# EAGLE design TAH BOARD VER 3.0 (EAGLE 6.4)
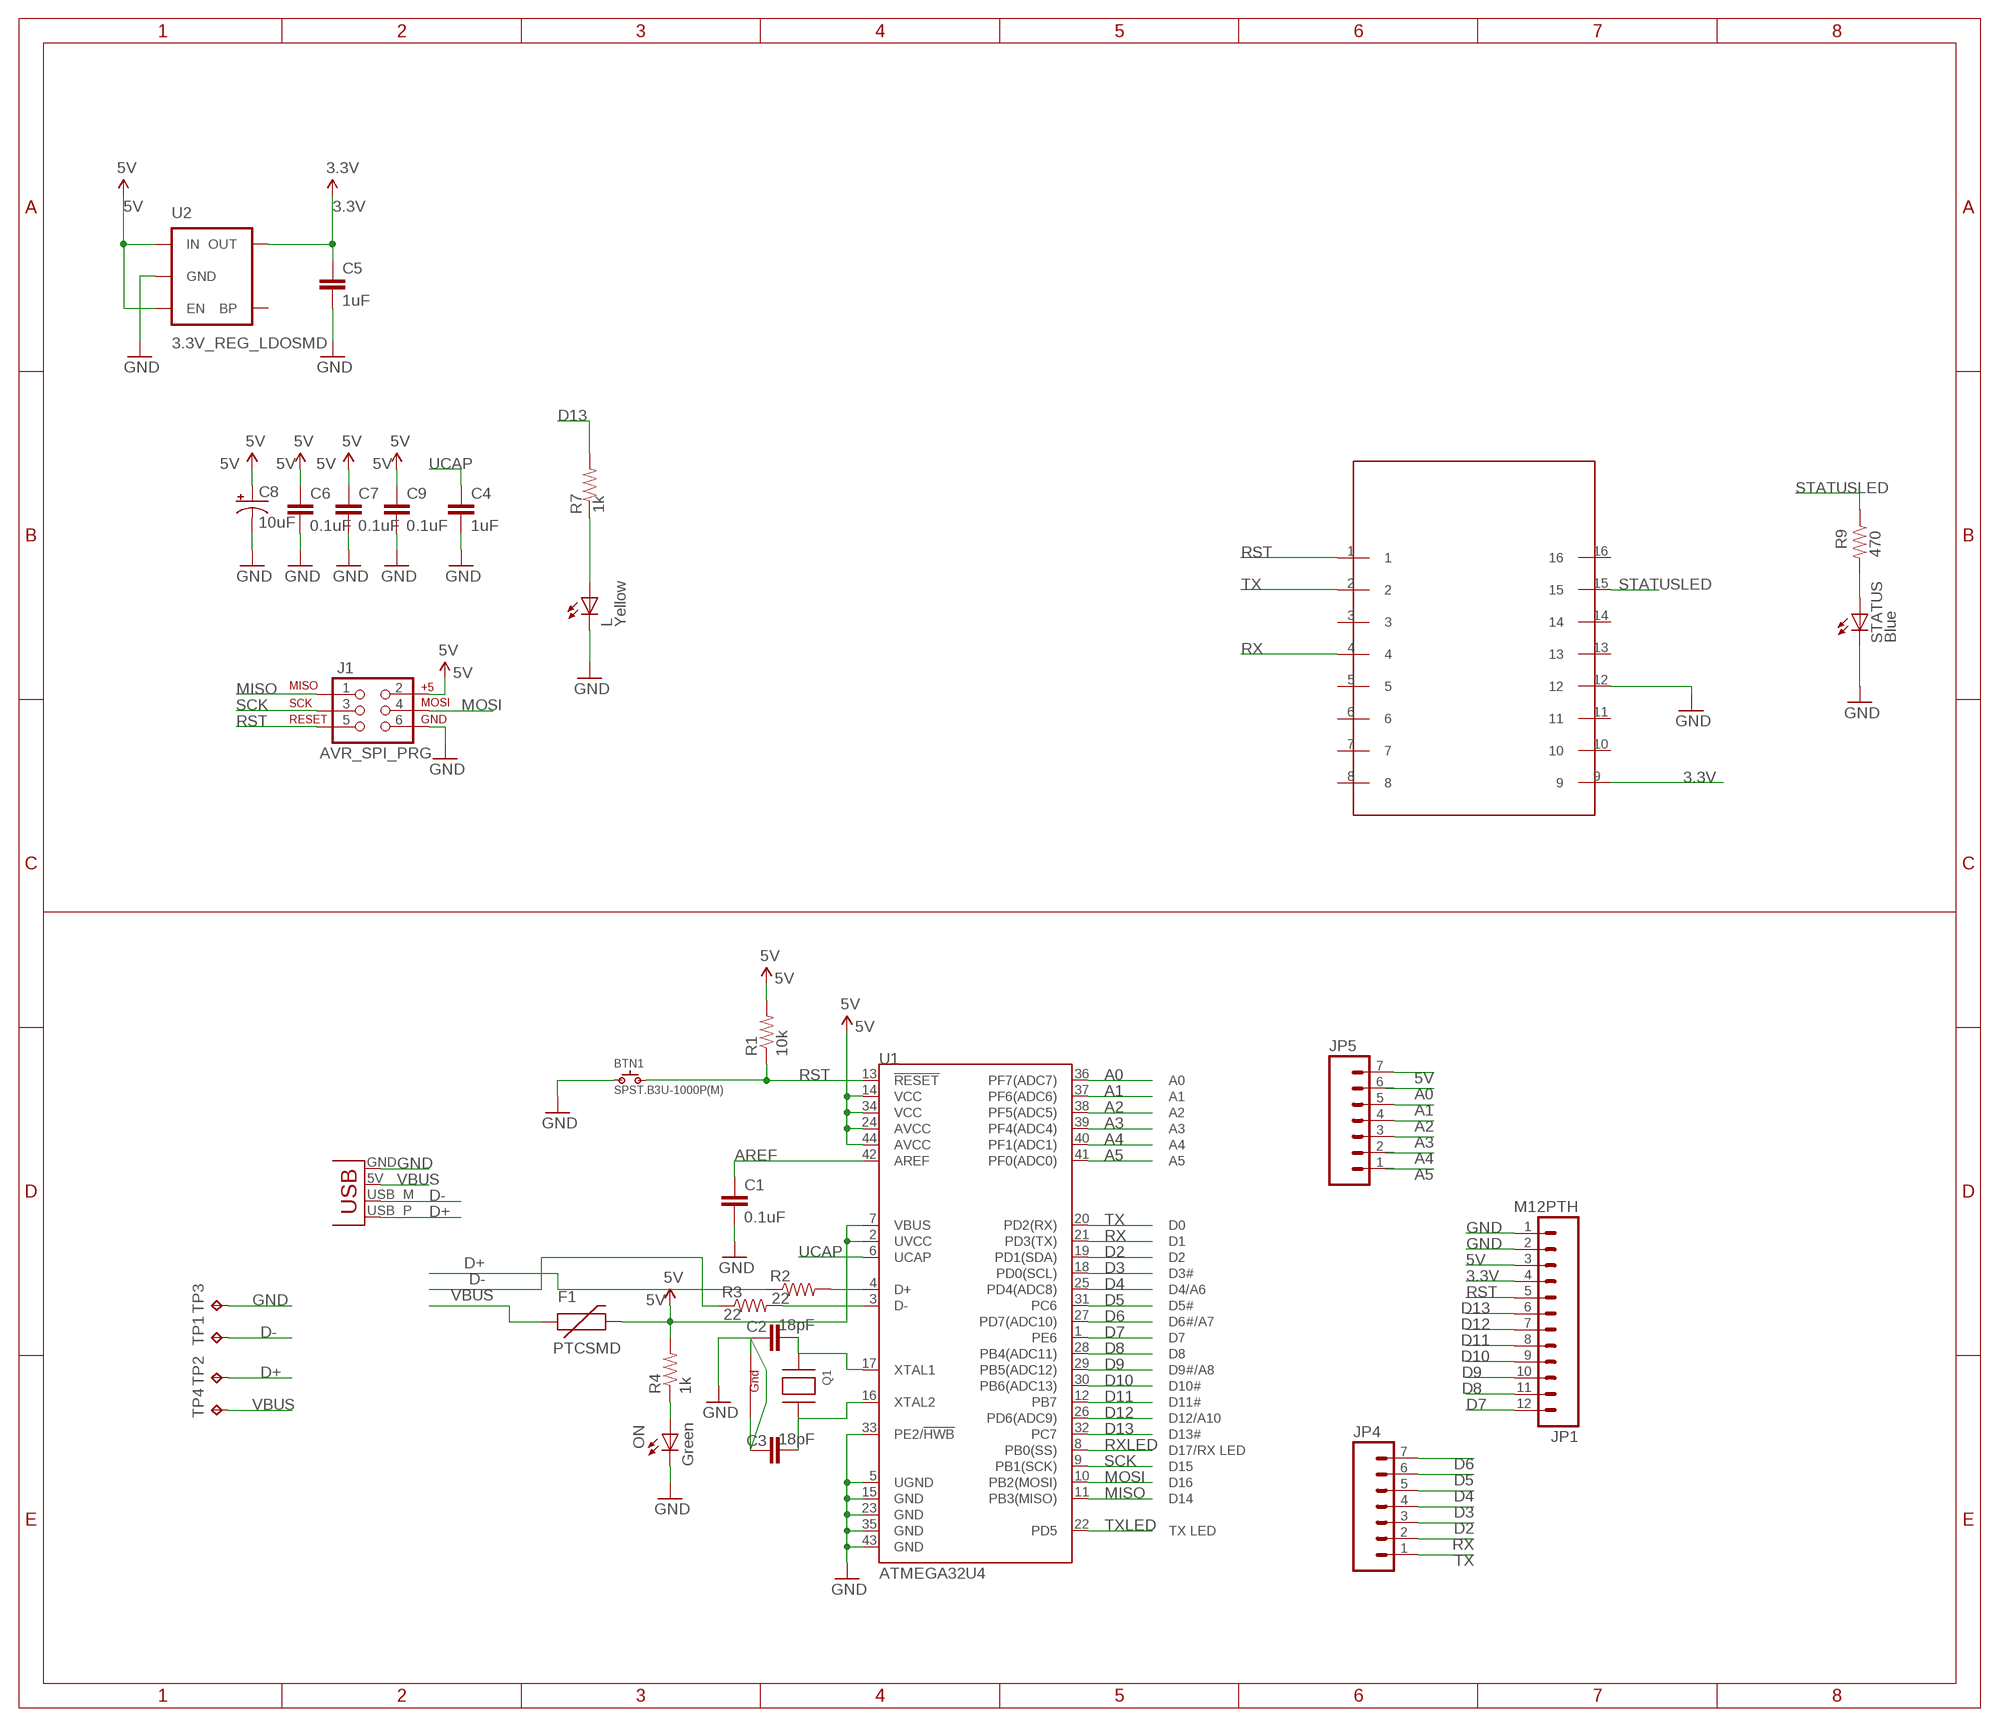
[diagram p0: schematic, sheet 1]

## Parts
BLE  HM-11HM11  [BC05B-SMD]
BTN1  SPST.B3U-1000P(M)  [B3U-1000P(M)]
C1  0.1uF  2.2UF-CERCAP-10009  [1206]
C2  18pF  2.2UF-CERCAP-10009  [1206]
C3  18pF  2.2UF-CERCAP-10009  [1206]
C4  1uF  2.2UF-CERCAP-10009  [1206]
C5  1uF  2.2UF-CERCAP-10009  [1206]
C6  0.1uF  2.2UF-CERCAP-10009  [1206]
C7  0.1uF  2.2UF-CERCAP-10009  [1206]
C8  10uF  CAP_POL1206  [EIA3216]
C9  0.1uF  2.2UF-CERCAP-10009  [1206]
F1  PTCSMD  [PTC-1206]
J1  AVR_SPI_PRG  AVR_SPI_PRG_6PTH  [2X3]
JP1  M12PTH  [1X12]
JP2  USBPCB  [USB-A-PCB]
JP4  M07  [1X07]
JP5  M07  [1X07]
L  Yellow  LEDSMT1206  [1206]
ON  Green  LEDSMT1206  [1206]
Q1  XTAL-4-3225  [NX3225]
R1  10k  RESISTOR1206  [1206]
R2  22  RESISTOR1206  [1206]
R3  22  RESISTOR1206  [1206]
R4  1k  RESISTOR1206  [1206]
R7  1k  RESISTOR1206  [1206]
R9  470  RESISTOR1206  [1206]
STATUS  Blue  LEDSMT1206  [1206]
TP1  TPTP11SQ  [TP11SQ]
TP2  TPTP11SQ  [TP11SQ]
TP3  TPTP11SQ  [TP11SQ]
TP4  TPTP11SQ  [TP11SQ]
U1  ATMEGA32U4  ATMEGA32U4TQFP  [SPARKFUN-DIGITALIC_TQFP44]
U2  3.3V_REG_LDOSMD  V_REG_LDOSMD  [SOT23-5]

## Nets
3.3V: BLE.9 C5.1 JP1.4 U2.5(OUT)
5V: C6.1 C7.1 C8.A(+) C9.1 F1.2 J1.2 JP1.3 JP5.7 R1.2 R4.2 U1.2(UVCC) U1.7(VBUS) U1.14(VCC) U1.24(AVCC) U1.34(VCC) U1.44(AVCC) U2.1(IN) U2.3(EN)
A0: JP5.6 U1.36(PF7(ADC7))
A1: JP5.5 U1.37(PF6(ADC6))
A2: JP5.4 U1.38(PF5(ADC5))
A3: JP5.3 U1.39(PF4(ADC4))
A4: JP5.2 U1.40(PF1(ADC1))
A5: JP5.1 U1.41(PF0(ADC0))
AREF: C1.1 U1.42(AREF)
D2: JP4.3 U1.19(PD1(SDA))
D3: JP4.4 U1.18(PD0(SCL))
D4: JP4.5 U1.25(PD4(ADC8))
D5: JP4.6 U1.31(PC6)
D6: JP4.7 U1.27(PD7(ADC10))
D7: JP1.12 U1.1(PE6)
D8: JP1.11 U1.28(PB4(ADC11))
D9: JP1.10 U1.29(PB5(ADC12))
D10: JP1.9 U1.30(PB6(ADC13))
D11: JP1.8 U1.12(PB7)
D12: JP1.7 U1.26(PD6(ADC9))
D13: JP1.6 R7.2 U1.32(PC7)
D+: JP2.USB_P(D+) R2.1 TP2.TP
D-: JP2.USB_M(D-) R3.1 TP1.TP
GND: BLE.12 BTN1.1 C1.2 C2.1 C3.1 C4.2 C5.2 C6.2 C7.2 C8.C(-) C9.2 J1.6 JP1.1 JP1.2 JP2.GND L.C ON.C Q1.2(G2) Q1.4(G1) STATUS.C TP3.TP U1.5(UGND) U1.15(GND) U1.23(GND) U1.33(PE2/!HWB) U1.35(GND) U1.43(GND) U2.2(GND)
MISO: J1.1 U1.11(PB3(MISO))
MOSI: J1.4 U1.10(PB2(MOSI))
N$1: L.A R7.1
N$2: C2.2 Q1.1(X1) U1.17(XTAL1)
N$3: C3.2 Q1.3(X2) U1.16(XTAL2)
N$6: R2.2 U1.4(D+)
N$8: R3.2 U1.3(D-)
N$9: ON.A R4.1
N$11: R9.2 STATUS.A
RST: BLE.1 BTN1.2 J1.5 JP1.5 R1.1 U1.13(!RESET)
RX: BLE.4 JP4.2 U1.21(PD3(TX))
RXLED: U1.8(PB0(SS))
SCK: J1.3 U1.9(PB1(SCK))
STATUSLED: BLE.15 R9.1
TX: BLE.2 JP4.1 U1.20(PD2(RX))
TXLED: U1.22(PD5)
UCAP: C4.1 U1.6(UCAP)
VBUS: F1.1 JP2.5V(VBUS) TP4.TP
Unconnected: BLE.3 BLE.5 BLE.6 BLE.7 BLE.8 BLE.10 BLE.11 BLE.13 BLE.14 BLE.16 U2.4(BP)

## Library data of the parts
BLE = HM-11:HM-11
BTN1 = omron:SPST
C1-C7 C9 = SparkFun-Capacitors:2.2UF-CER: 2.2uF Ceramic SMT CAP-07888- 10V, 20% (0603) CAP-10009- 50V, 10% (1206); PROD_ID: CAP-10009; VALUE: 2.2uF
C8 = SparkFun:CAP_POL: Capacitor Polarized These are standard SMD and PTH capacitors. Normally 10uF, 47uF, and 100uF in electrolytic and tantalum varieties. Always verify the external diameter of the through hole cap, it varies with capacity, voltage, and manufacturer. The EIA devices should be standard.
F1 = SparkFun:PTC: Resettable Fuse PTC Resettable Fuse. Spark Fun Electronics SKU : COM-08357
J1 = SparkFun:AVR_SPI_PRG_6: AVR ISP 6 Pin This is the reduced ISP connector for AVR programming. Common on Arduino. This footprint will take up less PCB space and can be used with a 10-pin to 6-pin adapter such as SKU: BOB-08508
JP1 = SparkFun-Connectors:M12: Header 12 Standard 12-pin 0.1" header. Use with straight break away headers (SKU : PRT-00116), right angle break away headers (PRT-00553), swiss pins (PRT-00743), machine pins (PRT-00117), and female headers (PRT-00115).
JP2 = SparkFun-Connectors:USB: USB Connectors USB-B-PTH is fully proven SKU : PRT-00139/CONN-08278 USB-miniB is fully proven SKU : PRT-00587 USB-A-PCB is untested. USB-A-H is throughly reviewed, but untested. Spark Fun Electronics SKU : PRT-00437 USB-B-SMT is throughly reviewed, but untested. Needs silkscreen touching up. USB-A-S has not been used/tested USB-MB-H has not been used/tested USB-MICROB has been used. CONN-09505
JP4 JP5 = SparkFun-Connectors:M07: Header 7 Standard 7-pin 0.1" header. Use with straight break away headers (SKU : PRT-00116), right angle break away headers (PRT-00553), swiss pins (PRT-00743), machine pins (PRT-00117), and female headers (PRT-00115). NOTES ON THE VARIANTS LOCK and LOCK_LONGPADS... This footprint was designed to help hold the alignment of a through-hole component (i.e. 7-pin header) while soldering it into place. You may notice that each hole has been shifted either up or down by 0.005 of an inch from it's more standard position (which is usually a perfectly straight line). This slight alteration caused the pins (the squares in the middle) to touch the edges of the holes. Because they are alternating, it causes a "brace" to hold the header in place. 0.005 has proven to be the perfect amount of "off-center" position when using our standard breakaway headers. Although looks a little odd when you look at the bare footprint, once you have a header in there, the alteration is very hard to notice. Also, if you push a header all the way into place, it is covered up entirely on the bottom side. This idea of altering the position of holes to aid alignment will be further integrated into the Sparkfun Library for other footprints. It can help hold any component with 3 or more connection pins.
L ON STATUS = 1n4148 diode sot 23:LED: LED OSRAM: - CHIPLED LG R971, LG N971, LY N971, LG Q971, LY Q971, LO R971, LY R971 LH N974, LH R974 LS Q976, LO Q976, LY Q976 LO Q996 - Hyper CHIPLED LW Q18S LB Q993, LB Q99A, LB R99A - SideLED LS A670, LO A670, LY A670, LG A670, LP A670 LB A673, LV A673, LT A673, LW A673 LH A674 LY A675 LS A676, LA A676, LO A676, LY A676, LW A676 LS A679, LY A679, LG A679 - Hyper Micro SIDELED® LS Y876, LA Y876, LO Y876, LY Y876 LT Y87S - SmartLED LW L88C, LW L88S LB L89C, LB L89S, LG L890 LS L89K, LO L89K, LY L89K LS L896, LA L896, LO L896, LY L896 - TOPLED LS T670, LO T670, LY T670, LG T670, LP T670 LSG T670, LSP T670, LSY T670, LOP T670, LYG T670 LG T671, LOG T671, LSG T671 LB T673, LV T673, LT T673, LW T673 LH T674 LS T676, LA T676, LO T676, LY T676, LB T676, LH T676, LSB T676, LW T676 LB T67C, LV T67C, LT T67C, LS T67K, LO T67K, LY T67K, LW E67C LS E67B, LA E67B, LO E67B, LY E67B, LB E67C, LV E67C, LT E67C LW T67C LS T679, LY T679, LG T679 LS T770, LO T770, LY T770, LG T770, LP T770 LB T773, LV T773, LT T773, LW T773 LH T774 LS E675, LA E675, LY E675, LS T675 LS T776, LA T776, LO T776, LY T776, LB T776 LHGB T686 LT T68C, LB T68C - Hyper Mini TOPLED® LB M676 - Mini TOPLED Santana® LG M470 LS M47K, LO M47K, LY M47K Source: http://www.osram.convergy.de/
Q1 = adafruit:XTAL-4: Classic 4-pin 3.2 x 2.5mm crystal
R1-R4 R7 R9 = SparkFun-Resistors:RESISTOR: Resistor Basic schematic elements and footprints for 0603, 1206, and PTH resistors.
TP1-TP4 = testpad:TP: Test pad
U1 = FTDI modifed:ATMEGA32U4: Atmel 44-pin 8-bit Microcontroller with 32KBytes of ISP Flash and USB Controller
U2 = SparkFun:V_REG_LDO: Voltage Regulator LDO Standard 150mA LDO voltage regulator in SOT-23 layout. Micrel part MIC5205. BP (by-pass) pin is used to lower output noise with 470pF cap.

## Net classes
0 default: clearance 0.355 mm

## Board
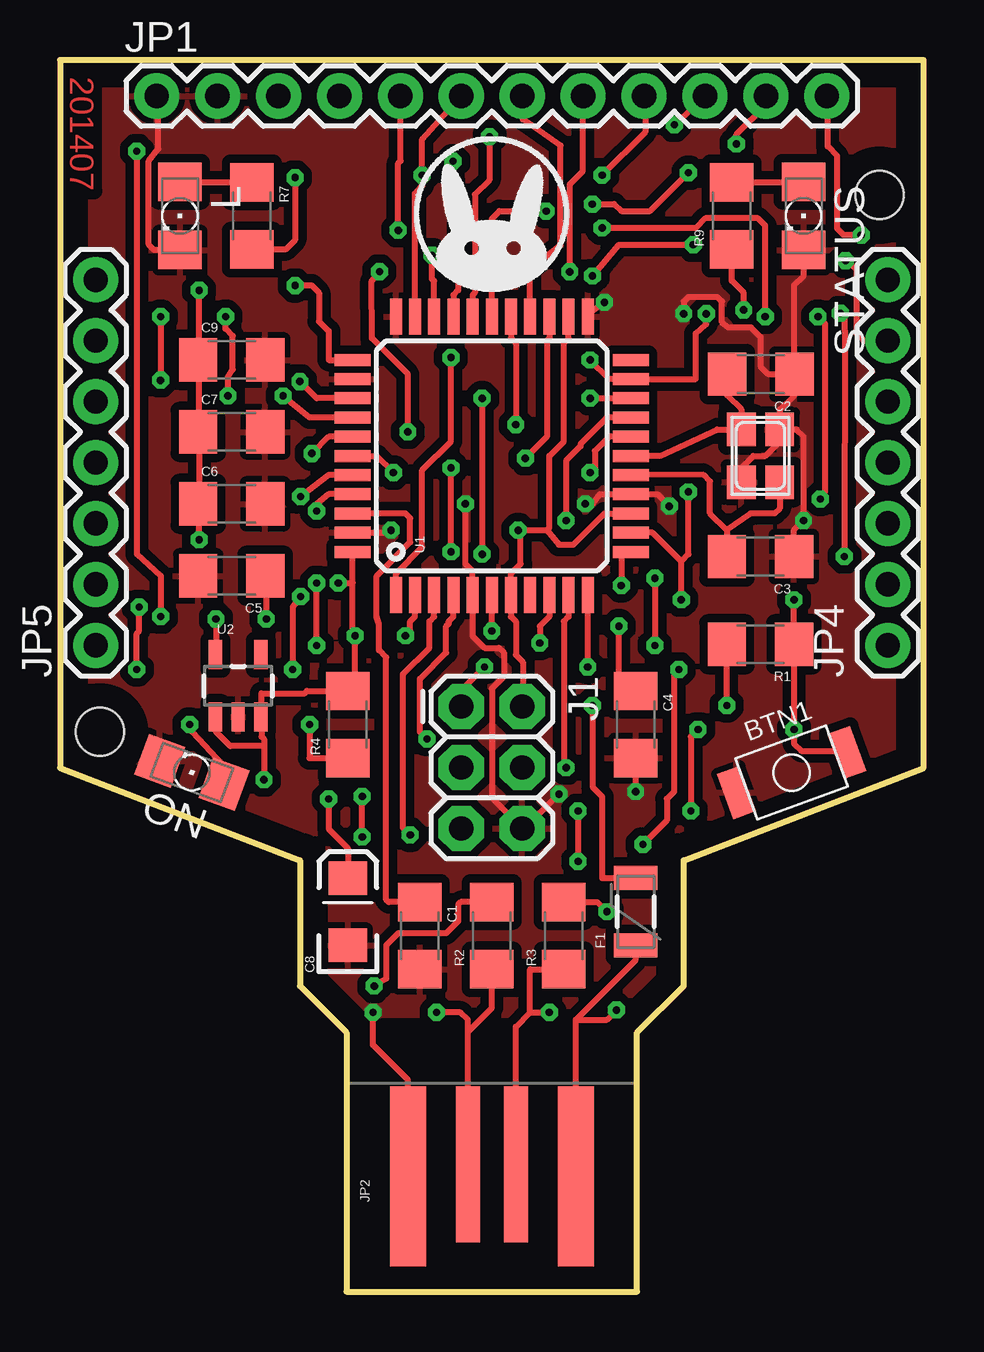
[diagram p1: board, top side]
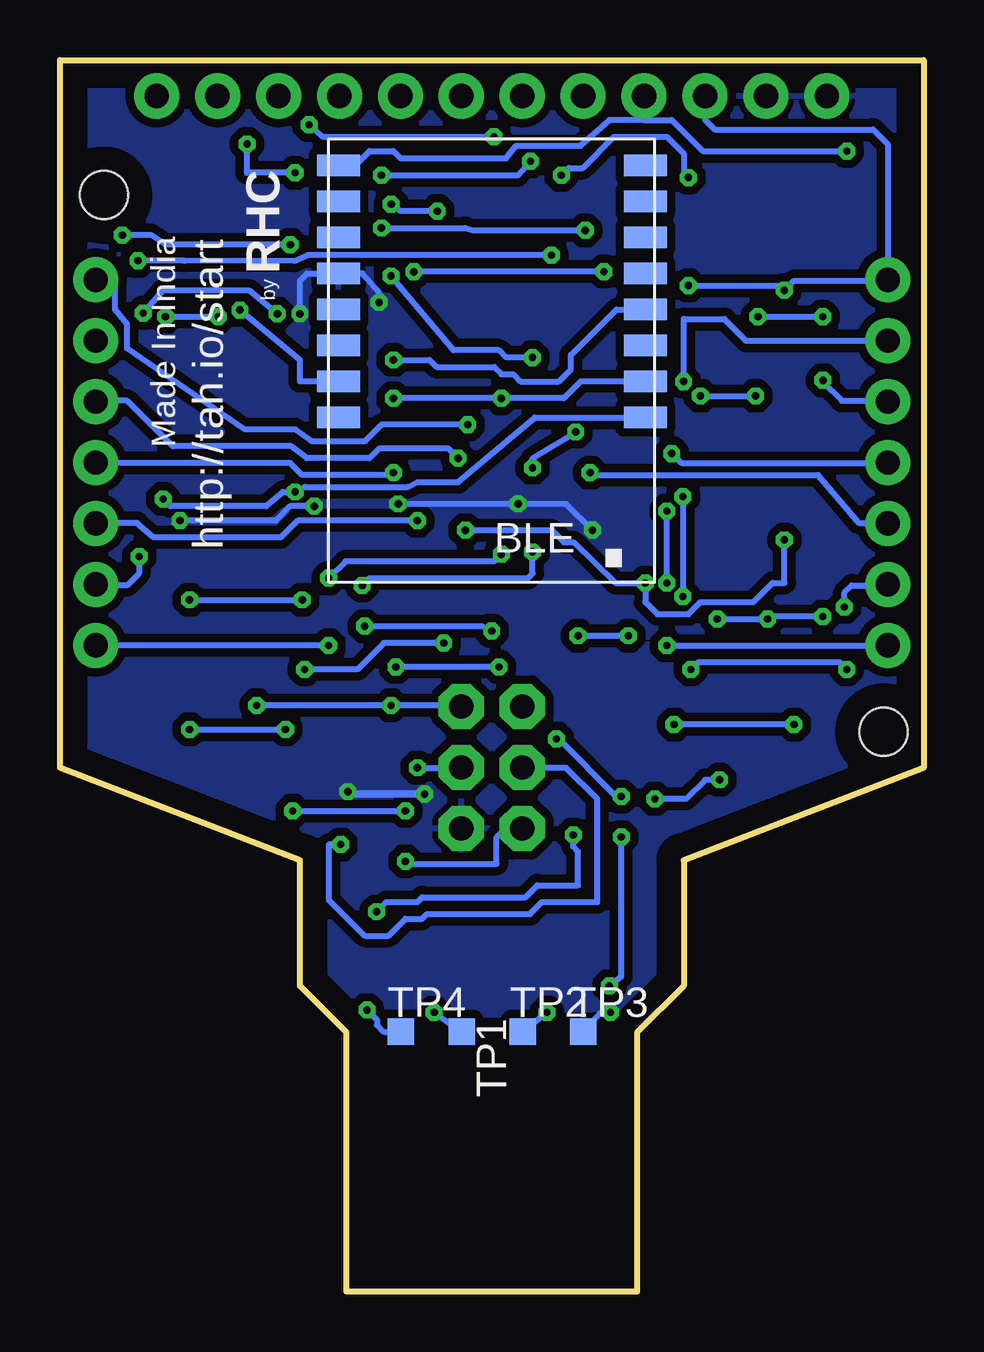
[diagram p2: board, bottom side, seen from below]

Size 36 x 51.34 mm. Coordinates in mm from the lower left corner, seen from the top.
Outline: 11.94,0 24.06,0 24.06,10.8 26,12.74 26,17.98 36,21.84 36,51.34 0,51.34 0,21.84 10,17.98 10,12.74 11.94,10.8 11.94,0
Copper layers (1*16): Top 0.035mm / dielectric 1.5mm / Bottom 0.035mm
Design rules "default": minimum track width 10mil, minimum drill 24mil, track to track 8mil, track to pad 8mil, pad to pad 8mil, via to via 8mil, smd to smd 8mil, copper to edge 40mil, drill to drill 8mil, minimum pad ring 10mil, minimum via ring 8mil, stop-mask expansion 4mil, vias tented up to drill 0mil, thermal gap 10mil
Holes 2 mm at 34.17,45.71 1.67,23.34

### Footprints (pad centres in the part's own frame; a part is rotated, then mirrored left to right if it is on the bottom)
BC05B-SMD = smd 1.8 x 0.9: 1 -6.4,3.4; 2 -6.4,1.9; 3 -6.4,0.4; 4 -6.4,-1.1; 5 -6.4,-2.6; 6 -6.4,-4.1; 7 -6.4,-5.6; 8 -6.4,-7.1; 9 6.38,-7.1; 10 6.38,-5.6; 11 6.38,-4.1; 12 6.38,-2.6; 13 6.38,-1.1; 14 6.38,0.4; 15 6.38,1.9; 16 6.38,3.4
B3U-1000P(M) = smd 1 x 2: 1 -2.45,0; 2 2.45,0
1206 = smd 1.6 x 1.8: 1 -1.4,0; 2 1.4,0
EIA3216 = smd 1.4 x 1.6: A 1.4,0; C -1.4,0
PTC-1206 = smd 1 x 1.8: 1 -1.4,0; 2 1.4,0
2X3 = drill 1.016 pad 1.88 octagon: 1 0,0; 2 0,2.54; 3 2.54,0; 4 2.54,2.54; 5 5.08,0; 6 5.08,2.54
1X12 = drill 1.016 pad 1.88: 1 0,0; 2 2.54,0; 3 5.08,0; 4 7.62,0; 5 10.16,0; 6 12.7,0; 7 15.24,0; 8 17.78,0; 9 20.32,0; 10 22.86,0; 11 25.4,0; 12 27.94,0
USB-A-PCB = smd 7.5 x 1.5: 5V -0.2,-3.5; GND -0.2,3.5 | smd 6.5 x 1: USB_M 0.3,-1; USB_P 0.3,1
1X07 = drill 1.016 pad 1.88: 1 0,0; 2 2.54,0; 3 5.08,0; 4 7.62,0; 5 10.16,0; 6 12.7,0; 7 15.24,0
1206' = smd 1.6 x 1.803: A -1.422,0; C 1.422,0
NX3225 = smd 1.4 x 1.2: 1 -1.1,-0.8; 2 1.1,-0.8; 3 1.1,0.8; 4 -1.1,0.8
TP11SQ = smd 1.1 x 1.1: TP 0,0
SPARKFUN-DIGITALIC_TQFP44 = smd 1.5 x 0.5: 1 -5.8,4; 2 -5.8,3.2; 3 -5.8,2.4; 4 -5.8,1.6; 5 -5.8,0.8; 6 -5.8,0; 7 -5.8,-0.8; 8 -5.8,-1.6; 9 -5.8,-2.4; 10 -5.8,-3.2; 11 -5.8,-4; 23 5.8,-4; 24 5.8,-3.2; 25 5.8,-2.4; 26 5.8,-1.6; 27 5.8,-0.8; 28 5.8,0; 29 5.8,0.8; 30 5.8,1.6; 31 5.8,2.4; 32 5.8,3.2; 33 5.8,4 | smd 0.5 x 1.5: 12 -4,-5.8; 13 -3.2,-5.8; 14 -2.4,-5.8; 15 -1.6,-5.8; 16 -0.8,-5.8; 17 0,-5.8; 18 0.8,-5.8; 19 1.6,-5.8; 20 2.4,-5.8; 21 3.2,-5.8; 22 4,-5.8; 34 4,5.8; 35 3.2,5.8; 36 2.4,5.8; 37 1.6,5.8; 38 0.8,5.8; 39 0,5.8; 40 -0.8,5.8; 41 -1.6,5.8; 42 -2.4,5.8; 43 -3.2,5.8; 44 -4,5.8
SOT23-5 = smd 0.55 x 1.2: 1 -0.95,-1.3; 2 0,-1.3; 3 0.95,-1.3; 4 0.95,1.3; 5 -0.95,1.3

### Placement (x,y rotation side)
BLE  18,39.84 180 bottom
BTN1  30.5,21.64 20 top
C1  15,14.84 270 top
C2  29.22,38.25 180 top
C3  29.2,30.64 180 top
C4  24,23.64 270 top
C5  7.16,29.84 180 top
C6  7.16,32.84 0 top
C7  7.16,35.84 0 top
C8  12,15.84 90 top
C9  7.16,38.84 0 top
F1  24,15.84 90 top
J1  16.73,24.39 270 top
JP1  4.03,49.84 0 top
JP2  18,5 90 top
JP4  34.51,26.94 90 top
JP5  1.49,26.94 90 top
L  Yellow  [1206']  5,44.84 270 top
ON  Green  [1206']  5.5,21.64 160 top
Q1  29.2,34.84 270 top
R1  29.2,26.99 180 top
R2  18,14.84 90 top
R3  21,14.84 90 top
R4  12,23.64 90 top
R7  8,44.84 270 top
R9  28,44.84 90 top
STATUS  Blue  [1206']  31,44.84 270 top
TP1  19.25,10.84 270 bottom
TP2  16.7,10.84 0 bottom
TP3  14.18,10.84 0 bottom
TP4  21.8,10.84 0 bottom
U1  18,34.84 90 top
U2  7.43,25.25 0 top
U$1  [TAHLOGO]  18,44.63 0 top

### Tracks (layer width: path | path; a pad name or v marks a point on that pad's centre or on a via)
3.3V  (via drill 0.3)
  Top 0.254: v6.5,28.04 6.5,26.64 U2.5 | v8.6,28.04 8.6,29.84 C5.1 | v4.2,28.14 4.2,29.84 3.2,30.74 v3.2,47.54
  Bottom 0.254: v8.6,28.04 v6.5,28.04 6.5,28.14 v4.2,28.14 | 11.65,48.84 JP1.4 | BLE.9 23.7,46.94 23.1,47.54 22.1,47.54 21.8,47.24 17.4,47.24 17,47.76 14.3,47.76 13.1,48.84 11.65,48.84 | v3.2,47.54 9.2,47.54 10.5,48.84 11.65,48.84
5V  (via drill 0.3)
  Top 0.254: v5.8,41.74 5.8,38.94 C9.1 5.8,38.84 5.8,35.94 C7.1 5.8,35.84 5.8,32.84 C6.1 5.8,32.74 v5.8,31.34 | U1.34 11.2,38.84 11.2,40.04 10.8,40.44 10.8,41.64 10.5,41.94 v9.8,41.94 | U1.2 14.8,28.14 14.6,27.94 14.6,27.54 v14.4,27.34 | 12.2,29.54 12.2,27.34 v12.3,27.34 12.3,25.04 R4.2 10.3,25.04 10.2,24.94 8.4,24.94 8.4,24.04 U2.3 8.4,23.94 8.4,23.14 8.5,23.04 8.5,22.74 | 12.2,29.54 U1.44 | 8.5,22.74 7.1,22.74 6.5,23.34 6.5,23.94 U2.1 | C8.A 12,18.48 11.63,18.86 11.2,19.29 v11.2,20.54 | 8.5,22.74 v8.5,21.34 | J1.2 19.3,24.44 19.3,26.24 19,26.54 19,27.94 18.8,28.14 U1.7 18.8,29.94 19.2,30.34 19.2,31.74 | U1.24 21.2,39.74 21,39.54 21,35.44 20.4,34.84 20.4,31.84 20.3,31.74 | F1.2 22.6,17.24 22.6,20.64 22.2,21.04 v22.2,24.44 | v27.8,24.44 R1.2 | v11.6,29.54 12.2,29.54 | v19.1,31.74 19.2,31.74 | 19.2,31.74 20.3,31.74 | 20.3,31.74 20.8,31.14 21.4,31.14 22.7,32.44 U1.14
  Bottom 0.254: v9.8,41.94 5.7,41.94 v5.8,41.74 5.4,42.14 1.5,42.14 JP5.7 1.5,47.84 2.1,48.44 8.7,48.44 9.11,48.85 JP1.3 | v12.3,27.34 v14.4,27.34 | v8.5,21.34 9.1,21.34 9.9,20.54 v11.2,20.54 | J1.2 19.3,24.44 v22.2,24.44 v27.8,24.44 | v19.1,31.74 15.5,31.74 15,31.24 14.6,31.24 12.85,29.54 v11.6,29.54 11.6,28.74 11.1,28.24 9.8,28.24 9.3,28.74 7.1,28.74 6.3,29.54 5.8,29.54 v5.8,31.34
A0  (via drill 0.3)
  Top 0.254: v10,37.94 10.7,37.24 U1.36
  Bottom 0.254: JP5.6 7.4,39.64 8.3,40.54 10,40.54 v10,37.94
A1  (via drill 0.3)
  Top 0.254: v4.19,37.99 4.2,38.32 v4.2,40.64 | v6.9,40.64 6.9,40.14 7.2,39.84 7.2,38.44 7,38.14 v7,37.34 | v9.3,37.34 10.4,36.44 U1.37
  Bottom 0.254: v4.19,37.99 4.19,37.92 3.41,37.14 1.5,37.14 JP5.5 | v6.9,40.64 v4.2,40.64 | v9.3,37.34 v7,37.34
A2  (via drill 0.3)
  Top 0.254: v10.5,34.94 11.2,35.64 U1.38
  Bottom 0.254: v10.5,34.94 10.1,34.54 1.5,34.54 JP5.4
A3  (via drill 0.3)
  Top 0.254: v13.9,34.14 13.2,34.84 U1.39
  Bottom 0.254: v13.9,34.14 13.7,34.04 4.4,34.04 2.7,32.04 1.5,32.04 JP5.3
A4  (via drill 0.3)
  Top 0.254: v3.2,25.94 3.2,27.44 3.3,27.54 v3.3,28.54 | v9.7,25.94 9.7,28.54 v10.03,28.98 | v10.03,33.14 11.2,34.04 U1.40
  Bottom 0.254: v3.3,28.54 3.3,29.14 3,29.44 1.5,29.44 JP5.2 | v3.2,25.94 3.5,26.24 9.4,26.24 v9.7,25.94 | v10.03,33.14 v10.03,28.98
A5  (via drill 0.3)
  Top 0.254: U1.41 11.2,33.24 10.7,32.84 v10.7,32.54 | v10.7,26.94 v10.7,29.54
  Bottom 0.254: v10.7,26.94 JP5.1 | v10.7,29.54 v10.7,32.54
AREF
  Top 0.254: U1.42 14.4,32.44 14.6,32.24 14.6,31.24 13.2,29.84 13.2,28.14 13.3,27.84 13.3,26.74 13.6,26.44 13.6,16.34 13.7,16.24 C1.1
D2  (via drill 0.3)
  Top 0.254: v21.1,32.14 21.1,34.64 21.7,35.24 21.7,35.34 22.8,36.44 U1.19
  Bottom 0.254: v21.1,32.14 26.1,32.14 26.8,31.44 32.1,31.44 32.8,32.04 34.5,32.04 JP4.3
D3  (via drill 0.3)
  Top 0.254: v22.1,34.14 22.3,34.34 22.3,35.04 22.9,35.64 U1.18
  Bottom 0.254: v22.1,34.14 22.2,34.04 25.9,34.04 26.4,34.54 34.5,34.54 JP4.4
D4  (via drill 0.3)
  Top 0.254: v19.4,34.74 20.3,35.64 20.3,39.64 20.4,39.74 U1.25
  Bottom 0.254: v19.4,34.74 19.8,35.14 22.7,35.14 23.1,34.74 25.7,34.74 26.36,35.24 31.3,35.24 33.2,37.14 34.5,37.14 JP4.5
D5  (via drill 0.3)
  Top 0.254: U1.31 15.6,42.13 15.51,42.22 v15.51,43.2 | v32.75,42.97 33.2,42.65 33.2,39.94 33.5,39.64 JP4.6
  Bottom 0.254: v15.51,43.2 25.69,43.2 26.22,42.96 30.82,42.97 v32.75,42.97
D6  (via drill 0.3)
  Top 0.254: v19,36.14 19,39.54 18.8,39.74 U1.27
  Bottom 0.254: v19,36.14 22.6,36.14 23.3,35.44 25.5,35.44 26.19,35.94 28.3,35.94 33.2,39.31 33.2,40.34 33.7,40.94 33.7,41.94 33.9,42.14 34.5,42.14 JP4.7
D7  (via drill 0.3)
  Top 0.254: v33.4,44.04 32.67,44.04 32.4,44.31 32.4,47.34 32,47.74 32,49.84 JP1.12 | v26.4,43.64 23.3,43.64 v22.2,42.34 | v16.3,38.94 16.3,35.44 15.1,34.24 15.1,31.04 14,29.94 U1.1
  Bottom 0.254: v26.4,43.64 31.6,43.64 32.2,44.04 v33.4,44.04 | v22.2,42.34 19.6,39.24 17.7,39.24 17.4,38.94 v16.3,38.94
D8  (via drill 0.3)
  Top 0.254: v28.2,47.84 28.2,48.24 29.4,49.44 29.4,49.84 JP1.11 | v26.2,46.64 24.6,45.04 23.4,45.04 23.1,45.34 v22.19,45.33 | v20.27,45.04 18.32,45.04 18,44.72 U1.28
  Bottom 0.254: v28.2,47.84 28.2,46.64 v26.2,46.64 | v22.19,45.33 21.8,45.04 v20.27,45.04
D9  (via drill 0.3)
  Top 0.254: U1.29 17.2,41.54 17.3,41.64 17.3,45.74 17.9,46.34 v17.91,48.14 | v25.61,48.64 JP1.10
  Bottom 0.254: v17.91,48.14 23.3,48.14 25.07,48.15 v25.61,48.64
D10  (via drill 0.3)
  Top 0.254: U1.30 16.4,41.54 16.6,41.74 16.59,45.56 16.41,45.74 v16.39,47.12 | v22.6,46.54 24.4,48.34 24.4,49.84 JP1.9
  Bottom 0.254: v22.6,46.54 16.91,46.53 v16.39,47.12
D11  (via drill 0.3)
  Top 0.254: v21.25,42.51 21.25,46.16 21.8,46.71 JP1.8 | v13.32,42.52 12.99,42.13 13,39.74 14.5,38.24 v14.5,35.84 | v16.3,30.84 v16.3,34.34 | v23.4,29.44 23.4,30.74 23.5,30.84 U1.12
  Bottom 0.254: v13.32,42.52 v21.25,42.51 | v14.5,35.84 16.3,34.74 v16.3,34.34 | v16.3,30.84 16.3,29.94 16.5,29.74 23.1,29.74 v23.4,29.44
D12
  Top 0.254: U1.26 19.6,42.63 20.87,43.62 20.87,47.77 19.3,48.87 19.3,49.84 JP1.7
D13  (via drill 0.3)
  Top 0.254: U1.32 14.8,45.77 15.1,46.1 v15.1,46.54 15.1,48.04 16.7,49.84 JP1.6 | R7.2 9.4,43.44 9.8,43.84 v9.8,46.44
  Bottom 0.254: v9.8,46.44 10,46.64 10,47.44 10.7,48.14 12.9,48.14 14.2,46.84 14.8,46.84 v15.1,46.54
D+  (via drill 0.3)
  Top 0.254: R2.1 18,11.84 17,10.84 | JP2.USB_P 17,10.84 | 17,10.84 17,11.34 16.7,11.64 v15.7,11.64
  Bottom 0.254: v15.7,11.64 TP2.TP
D-  (via drill 0.3)
  Top 0.254: R3.1 19.6,13.44 19.6,11.64 | 19.6,11.64 19,11.04 JP2.USB_M | 19.6,11.64 v20.4,11.64
  Bottom 0.254: v20.4,11.64 TP1.TP
GND  (via drill 0.3)
  Top 0.254: L.C 3.92,43.42 3.7,43.64 3.7,47.14 4.1,47.64 4.1,49.77 JP1.1 | U1.23 22,40.74 v22.7,41.24 | v20.8,20.74 19.37,19.31 J1.6 18,20.58 18,25.14 18.5,25.64 18.5,26.64 18.3,26.84 17.7,26.84 17.2,27.34 U1.5 17.2,30.04 16.9,30.34 v16.9,32.84 | v24,20.84 C4.2 | v21.9,32.84 22.2,32.84 22.5,33.24 U1.15 24.9,33.24 v25.4,32.74 | Q1.2 28.4,34.34 28.9,34.84 29.4,34.84 29.9,35.34 29.9,35.84 Q1.4 | C3.1 30.6,31.74 v31,32.14 31,35.64 30.7,35.94 Q1.4 | STATUS.C 31,42.34 30.6,41.94 30.6,38.27 C2.1 | U1.43 13.7,31.64 v13.8,31.74 | v26,40.76 26,41.27 26.2,41.46 27.4,41.46 27.6,41.27 27.6,40.4 27.86,40.19 28.81,40.19 29.2,39.79 29.2,38.56 29.51,38.25 C2.1 | C6.2 8.9,32.84 | C2.1 30.61,37.36 30,36.77 Q1.4 | JP2.GND 14.5,8.83 13.05,10.28 v13.05,11.64
  Bottom 0.254: v22.7,41.24 22.7,41.64 23.4,42.44 BLE.12 25.7,42.44 26,42.14 v26,40.76 | v21.9,32.84 v16.9,32.84 14.9,32.84 v13.8,31.74 | v25.4,32.74 26.4,32.74 27,32.14 v31,32.14 | v13.05,11.64 13.45,11.64 TP3.TP
  Bottom 0.305: v20.8,20.74 23.9,20.74 v24,20.84
  pour Bottom: 11.2,11.53 24.79,11.53 25.99,12.74 25.99,17.96 36,21.83 36,51.34 0,51.34 0,21.84 10,17.98 10,12.74
  pour Top: 11.2,11.53 24.79,11.53 25.99,12.74 25.99,17.96 36,21.83 36,51.34 0,51.33 0,21.84 10,17.98 10,12.74
MISO  (via drill 0.3)
  Top 0.254: v22,26.04 U1.11 | v17.7,26.04 16.7,25.04 16.7,24.44 J1.1
  Bottom 0.254: v17.7,26.04 v22,26.04
MOSI  (via drill 0.3)
  Top 0.254: v21.1,21.84 21,21.94 21,27.94 21.2,28.14 U1.10
  Bottom 0.254: v21.1,21.84 19.3,21.84 J1.4
N$1
  Top 0.254: R7.1 5,46.24 L.A
N$2
  Top 0.254: U1.17 25,34.84 27.4,35.94 Q1.1 28.4,36.78 27.82,37.36 C2.2
N$3
  Top 0.254: 27.8,31.74 28.8,32.44 29.79,32.44 30,32.65 Q1.3 | U1.16 26.82,34.05 27.1,33.77 27.1,32.44 27.8,31.74 | 27.8,31.74 C3.2
N$6  (via drill 0.3)
  Top 0.254: U1.4 16.4,28.14 16.2,27.94 16.2,27.84 16.1,27.74 16.1,26.64 15,25.54 15,23.34 v15.3,23.04 | v12.6,18.95 v12.6,20.64 | v13.1,12.74 13.6,13.04 13.6,14.44 14.1,14.94 16.1,14.94 16.6,15.44 16.6,16.14 16.7,16.24 R2.2
  Bottom 0.254: v15.3,23.04 15.2,23.04 12.83,20.64 v12.6,20.64 | v12.6,18.95 12.6,13.14 v13.1,12.74
N$8  (via drill 0.3)
  Top 0.254: U1.3 15.6,28.14 15.4,27.94 15.4,26.84 14.3,25.74 14.3,19.34 v14.6,19.04 | v22.8,15.84 22.4,16.24 R3.2
  Bottom 0.254: v14.6,19.04 14.6,18.54 14.4,18.34 14.4,16.94 16.1,16.94 16.6,16.44 20.9,16.44 21.1,16.24 22.4,16.24 v22.8,15.84
N$9  (via drill 0.3)
  Top 0.254: R4.1 10.4,22.24 v10.4,23.64 | v5.4,23.64 5.4,23.44 5.5,23.34 6.8,21.94 6.8,21.24 ON.A
  Bottom 0.254: v5.4,23.64 v10.4,23.64
N$11
  Top 0.254: R9.2 31,46.24 STATUS.A
RST  (via drill 0.3)
  Top 0.254: v21.6,20.04 v21.6,17.94 | v26.3,20.04 26.3,23.14 v26.6,23.44 | U1.13 24.7,31.64 25.9,30.44 | v25.9,28.84 25.9,30.44 | v30.6,28.84 R1.1 v30.6,23.44 30.6,22.84 30.9,22.54 32.8,22.54 BTN1.2 | v26.2,33.34 26.2,30.74 25.9,30.44 | v14.1,44.24 14.1,47.04 14.2,47.14 JP1.5 | v22.6,44.34 26.5,44.34 26.9,44.74 29.1,44.74 29.4,44.44 v29.4,40.64 | v31.6,40.64 31.9,40.33 31.9,33.34 v31.7,33.04
  Bottom 0.254: v21.6,17.94 21.5,17.84 17.8,17.84 17.8,18.94 17.4,19.34 16.8,19.34 J1.5 | v26.3,20.04 v21.6,20.04 | v30.6,23.44 v26.6,23.44 | v30.6,28.84 v25.9,28.84 | BLE.1 16.2,36.44 19.4,33.74 21.1,33.74 21.5,33.54 25.8,33.54 v26.2,33.34 26.7,33.34 27.4,32.74 31.4,32.74 v31.7,33.04 | v14.1,44.24 18.8,44.24 19.1,44.34 v22.6,44.34 | v31.6,40.64 v29.4,40.64
RX  (via drill 0.3)
  Top 0.254: v32.7,30.64 32.71,40.09 32.71,40.61 v32.53,40.79 | v26.94,40.76 26.93,40.31 26.5,39.94 26.5,38.04 U1.21 22.9,38.04 v22.1,38.84
  Bottom 0.254: v32.7,30.64 32.7,29.94 33.2,29.44 34.5,29.44 JP4.2 | v26.94,40.76 28.09,41.72 31.71,41.73 v32.53,40.79 | BLE.4 12.8,40.94 14.7,39.04 14.7,38.44 15.2,37.94 16.8,37.94 17.1,38.24 17.6,38.24 17.9,38.54 20.3,38.54 20.6,38.84 v22.1,38.84
SCK  (via drill 0.3)
  Top 0.254: v24.3,18.64 25.3,19.64 25.3,20.54 25.6,20.84 25.6,25.74 v25.8,25.94 | v20,27.04 20,27.74 20.4,28.14 U1.9
  Bottom 0.254: v24.3,18.64 24.8,18.64 24.8,16.34 23.3,14.84 22.3,14.84 21.6,15.54 20.9,15.54 20.7,15.74 16.4,15.74 15.9,16.24 13.6,16.24 13.6,20.54 14.9,21.84 16.7,21.84 J1.3 | v25.8,25.94 23.6,25.94 22.5,27.04 v20,27.04
STATUSLED  (via drill 0.3)
  Top 0.254: v28.5,40.92 28.5,41.64 28,42.14 R9.1
  Bottom 0.254: v28.5,40.92 26,38.84 26,37.94 BLE.15
TX  (via drill 0.3)
  Top 0.254: v24.8,29.74 v24.8,26.94 | v17.6,37.24 v17.6,30.74 | v22.1,37.24 U1.20
  Bottom 0.254: v24.8,26.94 JP4.1 | v24.8,29.74 24.1,30.44 17.9,30.44 v17.6,30.74 | BLE.2 14.3,37.94 15,37.24 v17.6,37.24 v22.1,37.24
UCAP  (via drill 0.3)
  Top 0.254: v18,27.54 U1.6 | v23.3,27.74 23.3,25.04 C4.1
  Bottom 0.254: v18,27.54 18.4,27.74 v23.3,27.74
VBUS  (via drill 0.3)
  Top 0.254: F1.1 24,13.84 21.5,11.34 | JP2.5V 21.5,11.34 | 21.5,11.34 22.8,11.34 v23.2,11.74
  Bottom 0.254: v23.2,11.74 22.79,11.33 22.79,11.12 22.51,10.84 TP4.TP

### Text on the board
Top: 201407
bPlace: RHC | by | Made In India | http://tah.io/start
_tNames: GND | 5V | 3.3V | RST | 13 | 12 | 11 | 10 | 9 | 8 | 7 | STATUS | ~ | L13 | ~ | 6 | VIN | ~ | 5 | A0 | ~ | 4 | A1 | 3 | A2 | ~ | 2 | A3 | TX | A4 | A5 | RX | Reset | ON | ICSP